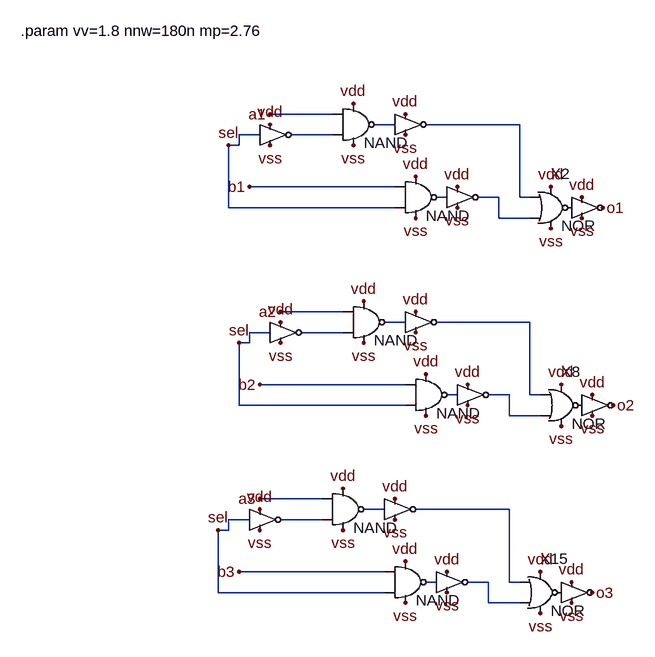
[diagram p0: schematic mux2x3b.asc]
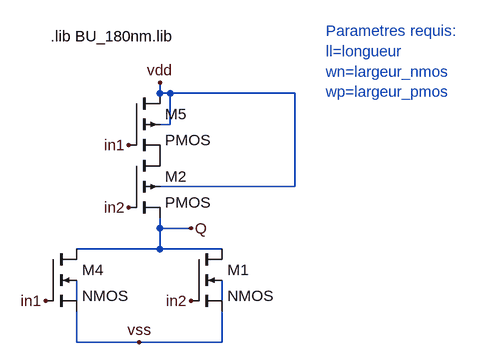
[diagram p1: sub-circuit nor.asc]
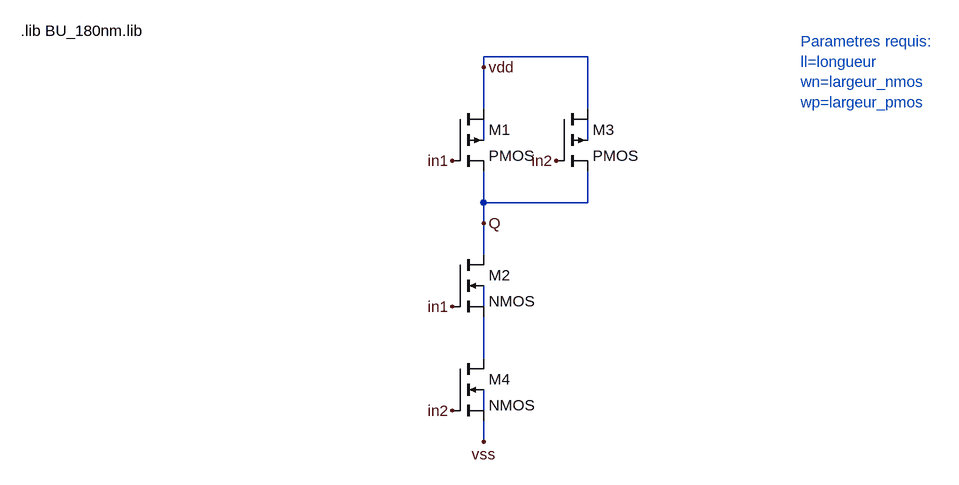
[diagram p2: sub-circuit nand.asc]
mux2x3b.asc, the LTspice schematic file:
Version 4
SHEET 1 2976 2984
WIRE 1280 608 1184 608
WIRE 1376 624 1344 624
WIRE 1568 624 1424 624
WIRE 1168 640 1136 640
WIRE 1280 640 1216 640
WIRE 1136 656 1136 640
WIRE 1136 656 1120 656
WIRE 1376 720 1152 720
WIRE 1456 736 1440 736
WIRE 1536 736 1504 736
WIRE 1568 736 1568 624
WIRE 1584 736 1568 736
WIRE 1120 752 1120 656
WIRE 1376 752 1120 752
WIRE 1536 768 1536 736
WIRE 1584 768 1536 768
WIRE 1296 912 1200 912
WIRE 1392 928 1360 928
WIRE 1584 928 1440 928
WIRE 1184 944 1152 944
WIRE 1296 944 1232 944
WIRE 1152 960 1152 944
WIRE 1152 960 1136 960
WIRE 1392 1024 1168 1024
WIRE 1472 1040 1456 1040
WIRE 1552 1040 1520 1040
WIRE 1584 1040 1584 928
WIRE 1600 1040 1584 1040
WIRE 1136 1056 1136 960
WIRE 1392 1056 1136 1056
WIRE 1552 1072 1552 1040
WIRE 1600 1072 1552 1072
WIRE 1264 1200 1168 1200
WIRE 1360 1216 1328 1216
WIRE 1552 1216 1408 1216
WIRE 1152 1232 1120 1232
WIRE 1264 1232 1200 1232
WIRE 1120 1248 1120 1232
WIRE 1120 1248 1104 1248
WIRE 1360 1312 1136 1312
WIRE 1440 1328 1424 1328
WIRE 1520 1328 1488 1328
WIRE 1552 1328 1552 1216
WIRE 1568 1328 1552 1328
WIRE 1104 1344 1104 1248
WIRE 1360 1344 1104 1344
WIRE 1520 1360 1520 1328
WIRE 1568 1360 1520 1360
FLAG 1184 608 a1
FLAG 1152 720 b1
FLAG 1120 656 sel
FLAG 1392 640 vss
FLAG 1312 656 vss
FLAG 1184 656 vss
FLAG 1408 768 vss
FLAG 1472 752 vss
FLAG 1616 784 vss
FLAG 1184 624 vdd
FLAG 1312 592 vdd
FLAG 1392 608 vdd
FLAG 1408 704 vdd
FLAG 1472 720 vdd
FLAG 1616 720 vdd
FLAG 1664 768 vss
FLAG 1664 736 vdd
FLAG 1696 752 o1
FLAG 1200 912 a2
FLAG 1168 1024 b2
FLAG 1136 960 sel
FLAG 1408 944 vss
FLAG 1328 960 vss
FLAG 1200 960 vss
FLAG 1424 1072 vss
FLAG 1488 1056 vss
FLAG 1632 1088 vss
FLAG 1200 928 vdd
FLAG 1328 896 vdd
FLAG 1408 912 vdd
FLAG 1424 1008 vdd
FLAG 1488 1024 vdd
FLAG 1632 1024 vdd
FLAG 1680 1072 vss
FLAG 1680 1040 vdd
FLAG 1712 1056 o2
FLAG 1168 1200 a3
FLAG 1136 1312 b3
FLAG 1104 1248 sel
FLAG 1376 1232 vss
FLAG 1296 1248 vss
FLAG 1168 1248 vss
FLAG 1392 1360 vss
FLAG 1456 1344 vss
FLAG 1600 1376 vss
FLAG 1168 1216 vdd
FLAG 1296 1184 vdd
FLAG 1376 1200 vdd
FLAG 1392 1296 vdd
FLAG 1456 1312 vdd
FLAG 1600 1312 vdd
FLAG 1648 1360 vss
FLAG 1648 1328 vdd
FLAG 1680 1344 o3
SYMBOL nor 1616 752 R0
SYMATTR InstName X2
SYMATTR SpiceLine ll=180n wn={nnw} wp={nnw*mp}
SYMBOL inv 1184 640 R0
WINDOW 0 -8 -32 Invisible 2
SYMATTR InstName X3
SYMATTR SpiceLine ll=180n wn={nnw} wp={nnw*mp}
SYMBOL nand 1312 624 R0
WINDOW 0 16 -32 Invisible 2
SYMATTR InstName X1
SYMATTR SpiceLine ll=180n wn={nnw} wp={nnw*mp}
SYMBOL inv 1392 624 R0
WINDOW 0 -8 -32 Invisible 2
SYMATTR InstName X4
SYMATTR SpiceLine ll=180n wn={nnw} wp={nnw*mp}
SYMBOL nand 1408 736 R0
WINDOW 0 16 -32 Invisible 2
SYMATTR InstName X5
SYMATTR SpiceLine ll=180n wn={nnw} wp={nnw*mp}
SYMBOL inv 1472 736 R0
WINDOW 0 -8 -32 Invisible 2
SYMATTR InstName X6
SYMATTR SpiceLine ll=180n wn={nnw} wp={nnw*mp}
SYMBOL inv 1664 752 R0
WINDOW 0 -8 -32 Invisible 2
SYMATTR InstName X7
SYMATTR SpiceLine ll=180n wn={nnw} wp={nnw*mp}
SYMBOL nor 1632 1056 R0
SYMATTR InstName X8
SYMATTR SpiceLine ll=180n wn={nnw} wp={nnw*mp}
SYMBOL inv 1200 944 R0
WINDOW 0 -8 -32 Invisible 2
SYMATTR InstName X9
SYMATTR SpiceLine ll=180n wn={nnw} wp={nnw*mp}
SYMBOL nand 1328 928 R0
WINDOW 0 16 -32 Invisible 2
SYMATTR InstName X10
SYMATTR SpiceLine ll=180n wn={nnw} wp={nnw*mp}
SYMBOL inv 1408 928 R0
WINDOW 0 -8 -32 Invisible 2
SYMATTR InstName X11
SYMATTR SpiceLine ll=180n wn={nnw} wp={nnw*mp}
SYMBOL nand 1424 1040 R0
WINDOW 0 16 -32 Invisible 2
SYMATTR InstName X12
SYMATTR SpiceLine ll=180n wn={nnw} wp={nnw*mp}
SYMBOL inv 1488 1040 R0
WINDOW 0 -8 -32 Invisible 2
SYMATTR InstName X13
SYMATTR SpiceLine ll=180n wn={nnw} wp={nnw*mp}
SYMBOL inv 1680 1056 R0
WINDOW 0 -8 -32 Invisible 2
SYMATTR InstName X14
SYMATTR SpiceLine ll=180n wn={nnw} wp={nnw*mp}
SYMBOL nor 1600 1344 R0
SYMATTR InstName X15
SYMATTR SpiceLine ll=180n wn={nnw} wp={nnw*mp}
SYMBOL inv 1168 1232 R0
WINDOW 0 -8 -32 Invisible 2
SYMATTR InstName X16
SYMATTR SpiceLine ll=180n wn={nnw} wp={nnw*mp}
SYMBOL nand 1296 1216 R0
WINDOW 0 16 -32 Invisible 2
SYMATTR InstName X17
SYMATTR SpiceLine ll=180n wn={nnw} wp={nnw*mp}
SYMBOL inv 1376 1216 R0
WINDOW 0 -8 -32 Invisible 2
SYMATTR InstName X18
SYMATTR SpiceLine ll=180n wn={nnw} wp={nnw*mp}
SYMBOL nand 1392 1328 R0
WINDOW 0 16 -32 Invisible 2
SYMATTR InstName X19
SYMATTR SpiceLine ll=180n wn={nnw} wp={nnw*mp}
SYMBOL inv 1456 1328 R0
WINDOW 0 -8 -32 Invisible 2
SYMATTR InstName X20
SYMATTR SpiceLine ll=180n wn={nnw} wp={nnw*mp}
SYMBOL inv 1648 1344 R0
WINDOW 0 -8 -32 Invisible 2
SYMATTR InstName X21
SYMATTR SpiceLine ll=180n wn={nnw} wp={nnw*mp}
TEXT 800 480 Left 2 !.param vv=1.8 nnw=180n mp=2.76

nor.asc, the sub-circuit schematic file:
Version 4
SHEET 1 1252 1108
WIRE 320 288 320 272
WIRE 336 288 320 288
WIRE 528 288 336 288
WIRE 336 336 336 288
WIRE 336 336 320 336
WIRE 528 432 528 288
WIRE 528 432 320 432
WIRE 320 496 320 480
WIRE 368 496 320 496
WIRE 320 528 320 496
WIRE 320 528 192 528
WIRE 416 528 320 528
WIRE 192 608 192 576
WIRE 416 608 416 576
WIRE 192 672 192 624
WIRE 288 672 192 672
WIRE 416 672 416 624
WIRE 416 672 288 672
FLAG 320 272 vdd
FLAG 288 672 vss
FLAG 144 608 in1
FLAG 368 608 in2
FLAG 272 464 in2
FLAG 272 368 in1
FLAG 368 496 Q
SYMBOL nmos4 368 528 R0
SYMATTR InstName M1
SYMATTR Value2 l={ll} w={wn} ad={450n*{wn}} as={450n*{wn}} pd={900n+{wn}} ps={1080n+{wn}}
SYMBOL nmos4 144 528 R0
SYMATTR InstName M4
SYMATTR Value2 l={ll} w={2*wn} ad={450n*{wn}} as={450n*{wn}} pd={900n+{wn}} ps={1080n+{wn}}
SYMBOL pmos4 272 288 R0
SYMATTR InstName M5
SYMATTR Value2 l={ll} w={2*wp} ad={450n*{wp}} as={450n*{wp}} pd={900n+{wp}} ps={1080n+{wp}}
SYMBOL pmos4 272 384 R0
SYMATTR InstName M2
SYMATTR Value2 l={ll} w={2*wp} ad={450n*{wp}} as={450n*{wp}} pd={900n+{wp}} ps={1080n+{wp}}
TEXT 152 200 Left 2 !.lib BU_180nm.lib
TEXT 576 192 Left 2 ;Parametres requis: \nll=longueur \nwn=largeur_nmos \nwp=largeur_pmos

nand.asc, the sub-circuit schematic file:
Version 4
SHEET 1 1192 836
WIRE 608 160 448 160
WIRE 448 176 448 160
WIRE 448 240 448 176
WIRE 608 240 608 160
WIRE 448 288 448 256
WIRE 608 288 608 256
WIRE 448 384 448 336
WIRE 608 384 608 336
WIRE 608 384 448 384
WIRE 448 416 448 384
WIRE 448 464 448 416
WIRE 448 544 448 512
WIRE 448 624 448 560
WIRE 448 704 448 672
WIRE 448 752 448 720
FLAG 448 176 vdd
FLAG 448 416 Q
FLAG 400 320 in1
FLAG 560 320 in2
FLAG 400 544 in1
FLAG 400 704 in2
FLAG 448 752 vss
SYMBOL pmos4 400 240 R0
SYMATTR InstName M1
SYMATTR Value2 l={ll} w={wp} ad={450n*{wp}} as={450n*{wp}} pd={900n+{wp}} ps={1080n+{wp}}
SYMBOL pmos4 560 240 R0
SYMATTR InstName M3
SYMATTR Value2 l={ll} w={wp} ad={450n*{wp}} as={450n*{wp}} pd={900n+{wp}} ps={1080n+{wp}}
SYMBOL nmos4 400 464 R0
SYMATTR InstName M2
SYMATTR Value2 l={ll} w={2*wn} ad={450n*{wn}} as={450n*{wn}} pd={900n+{wn}} ps={1080n+{wn}}
SYMBOL nmos4 400 624 R0
SYMATTR InstName M4
SYMATTR Value2 l={ll} w={2*wn} ad={450n*{wn}} as={450n*{wn}} pd={900n+{wn}} ps={1080n+{wn}}
TEXT -264 120 Left 2 !.lib BU_180nm.lib
TEXT 936 136 Left 2 ;Parametres requis: \nll=longueur \nwn=largeur_nmos \nwp=largeur_pmos

The netlist it stands for:
* mux2x3b.asc
XX2 N002 P001 vdd vss N005 nor params: NOR ll=180n wn={nnw} wp={nnw*mp}
XX3 sel N003 vdd vss inv ll=180n wn={nnw} wp={nnw*mp}  ; pins In _Q vdd vss
XX1 a1 N001 vdd vss N003 nand params: NAND ll=180n wn={nnw} wp={nnw*mp}
XX4 N001 N002 vdd vss inv ll=180n wn={nnw} wp={nnw*mp}  ; pins In _Q vdd vss
XX5 b1 N004 vdd vss sel nand params: NAND ll=180n wn={nnw} wp={nnw*mp}
XX6 N004 N005 vdd vss inv ll=180n wn={nnw} wp={nnw*mp}  ; pins In _Q vdd vss
XX7 P001 o1 vdd vss inv ll=180n wn={nnw} wp={nnw*mp}  ; pins In _Q vdd vss
XX8 N007 P002 vdd vss N010 nor params: NOR ll=180n wn={nnw} wp={nnw*mp}
XX9 sel N008 vdd vss inv ll=180n wn={nnw} wp={nnw*mp}  ; pins In _Q vdd vss
XX10 a2 N006 vdd vss N008 nand params: NAND ll=180n wn={nnw} wp={nnw*mp}
XX11 N006 N007 vdd vss inv ll=180n wn={nnw} wp={nnw*mp}  ; pins In _Q vdd vss
XX12 b2 N009 vdd vss sel nand params: NAND ll=180n wn={nnw} wp={nnw*mp}
XX13 N009 N010 vdd vss inv ll=180n wn={nnw} wp={nnw*mp}  ; pins In _Q vdd vss
XX14 P002 o2 vdd vss inv ll=180n wn={nnw} wp={nnw*mp}  ; pins In _Q vdd vss
XX15 N012 P003 vdd vss N015 nor params: NOR ll=180n wn={nnw} wp={nnw*mp}
XX16 sel N013 vdd vss inv ll=180n wn={nnw} wp={nnw*mp}  ; pins In _Q vdd vss
XX17 a3 N011 vdd vss N013 nand params: NAND ll=180n wn={nnw} wp={nnw*mp}
XX18 N011 N012 vdd vss inv ll=180n wn={nnw} wp={nnw*mp}  ; pins In _Q vdd vss
XX19 b3 N014 vdd vss sel nand params: NAND ll=180n wn={nnw} wp={nnw*mp}
XX20 N014 N015 vdd vss inv ll=180n wn={nnw} wp={nnw*mp}  ; pins In _Q vdd vss
XX21 P003 o3 vdd vss inv ll=180n wn={nnw} wp={nnw*mp}  ; pins In _Q vdd vss

* block symbol definitions
.subckt nor in1 Q vdd vss in2
M1 Q in2 vss N002 NMOS l={ll} w={wn} ad={450n*{wn}} as={450n*{wn}} pd={900n+{wn}} ps={1080n+{wn}}
M4 Q in1 vss N001 NMOS l={ll} w={2*wn} ad={450n*{wn}} as={450n*{wn}} pd={900n+{wn}} ps={1080n+{wn}}
M5 vdd in1 P001 vdd PMOS l={ll} w={2*wp} ad={450n*{wp}} as={450n*{wp}} pd={900n+{wp}} ps={1080n+{wp}}
M2 P001 in2 Q vdd PMOS l={ll} w={2*wp} ad={450n*{wp}} as={450n*{wp}} pd={900n+{wp}} ps={1080n+{wp}}
.lib BU_180nm.lib
* Parametres requis:
* ll=longueur
* wn=largeur_nmos
* wp=largeur_pmos
.ends nor

.subckt nand in1 Q vdd vss in2
M1 vdd in1 Q N001 PMOS l={ll} w={wp} ad={450n*{wp}} as={450n*{wp}} pd={900n+{wp}} ps={1080n+{wp}}
M3 vdd in2 Q N002 PMOS l={ll} w={wp} ad={450n*{wp}} as={450n*{wp}} pd={900n+{wp}} ps={1080n+{wp}}
M2 Q in1 N004 N003 NMOS l={ll} w={2*wn} ad={450n*{wn}} as={450n*{wn}} pd={900n+{wn}} ps={1080n+{wn}}
M4 N004 in2 vss N005 NMOS l={ll} w={2*wn} ad={450n*{wn}} as={450n*{wn}} pd={900n+{wn}} ps={1080n+{wn}}
.lib BU_180nm.lib
* Parametres requis:
* ll=longueur
* wn=largeur_nmos
* wp=largeur_pmos
.ends nand

.model NMOS NMOS
.model PMOS PMOS
.lib standard.mos
.param vv=1.8 nnw=180n mp=2.76
.backanno
.end